# Altium schematic sheet 0_Architecture.SchDoc
size A4; Organization: SpaceLab UFSC; Address1: UFSC - SpaceLab; Address2: University Campus - Trindade; Address3: Dep. of Electrical Engineering - CTC; Address4: Florianópolis, Santa Catarina, Brazil; DocumentNumber: 1; SheetNumber: 1; SheetTotal: 4; Address5: CEP: 88040 - 900
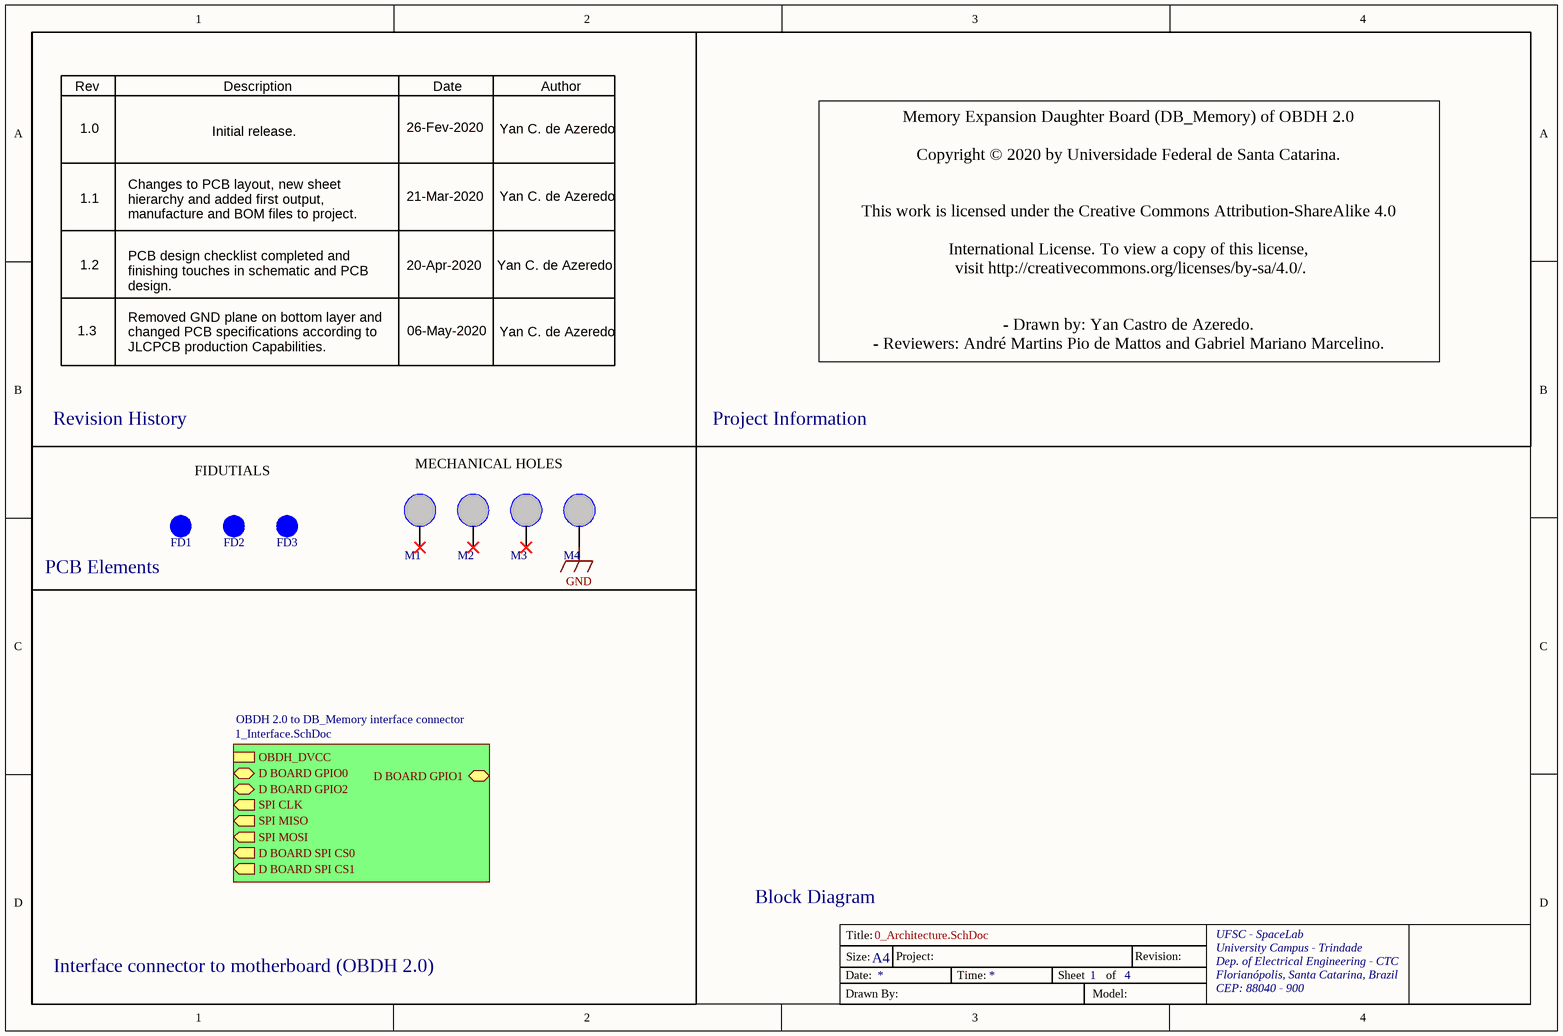
[diagram p0: 0_Architecture.SchDoc]

## Parts
FD1  Fiducial  [Fiducial 1.3mm]  (value not drawn)  (no BOM)
FD2  Fiducial  [Fiducial 1.3mm]  (value not drawn)  (no BOM)
FD3  Fiducial  [Fiducial 1.3mm]  (value not drawn)  (no BOM)
M1  DB Mechanical Hole  [DB Mechanical Hole]  (value not drawn)  (no BOM)
M2  DB Mechanical Hole  [DB Mechanical Hole]  (value not drawn)  (no BOM)
M3  DB Mechanical Hole  [DB Mechanical Hole]  (value not drawn)  (no BOM)
M4  DB Mechanical Hole  [DB Mechanical Hole]  (value not drawn)  (no BOM)

## Sub-sheets
OBDH 2.0 to DB_Memory interface connector = 1_Interface.SchDoc: OBDH_DVCC, D BOARD SPI CS1 (out), D BOARD SPI CS0 (out), SPI CLK (out), SPI MISO (out), D BOARD GPIO2 (bidir), D BOARD GPIO0 (bidir), SPI MOSI (out), D BOARD GPIO1 (bidir)

## Nets
GND: M4.0

Not connected (* = marked no-connect by the designer): M1 0*; M2 0*; M3 0*

## Notes on the sheet
- Rev
- Description
- Date
- Author
- 1.0
- Initial release.
- 26-Fev-2020
- Yan C. de Azeredo
- 1.1
- Changes to PCB layout, new sheet hierarchy and added first output, manufacture and BOM files to project.
- 21-Mar-2020
- 1.2
- PCB design checklist completed and finishing touches in schematic and PCB design.
- 20-Apr-2020
- 1.3
- Removed GND plane on bottom layer and changed PCB specifications according to JLCPCB production Capabilities.
- 06-May-2020
- Memory Expansion Daughter Board (DB_Memory) of OBDH 2.0
  Copyright © 2020 by Universidade Federal de Santa Catarina.
  This work is licensed under the Creative Commons Attribution-ShareAlike 4.0
  International License. To view a copy of this license,
  visit http://creativecommons.org/licenses/by-sa/4.0/.
  - Drawn by: Yan Castro de Azeredo.
  - Reviewers: André Martins Pio de Mattos and Gabriel Mariano Marcelino.
  - Based on OBDH 2.0 designed by: André Martins Pio de Mattos.
  - Support: Kleber Reis Gouveia Júnior.
- Revision History
- Project Information
- FIDUTIALS
- MECHANICAL HOLES
- (near FD1) PCB Elements
- Block Diagram
- Interface connector to motherboard (OBDH 2.0)
- Date:
- Title:
- Size:
- A4
- Project:
- Time:
- Sheet
- of
- Revision:
- UFSC - SpaceLab
- University Campus - Trindade
- Dep. of Electrical Engineering - CTC
- Florianópolis, Santa Catarina, Brazil
- CEP: 88040 - 900
- Drawn By:
- Model:

## Library data of the parts
FD1-FD3 = Fiducial: Fiducial for DB board variants
M1-M4 = DB Mechanical Hole: Mechanical Hole for DB board variants